# Altium schematic sheet Sail Sheetmap.SchDoc
size A; SheetNumber: 6; SheetTotal: 6
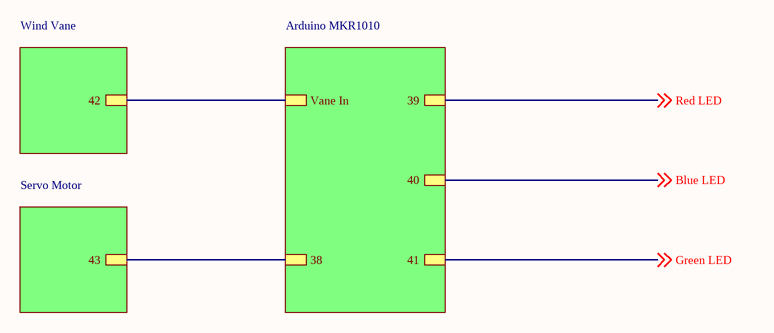
[diagram p0: Sail Sheetmap.SchDoc]

## Sub-sheets
Arduino MKR1010 = File Name: Vane In, 38, 39, 40, 41
Servo Motor = File Name: 43
Wind Vane = File Name: 42

## Nets
Blue LED: off-sheet Blue LED, sheet Arduino MKR1010/40
Green LED: off-sheet Green LED, sheet Arduino MKR1010/41
Red LED: off-sheet Red LED, sheet Arduino MKR1010/39
(unnamed): sheet Arduino MKR1010/Vane In, sheet Wind Vane/42
(unnamed): sheet Arduino MKR1010/38, sheet Servo Motor/43